# EAGLE design PixiFlood_SMT (EAGLE 7.3.0)
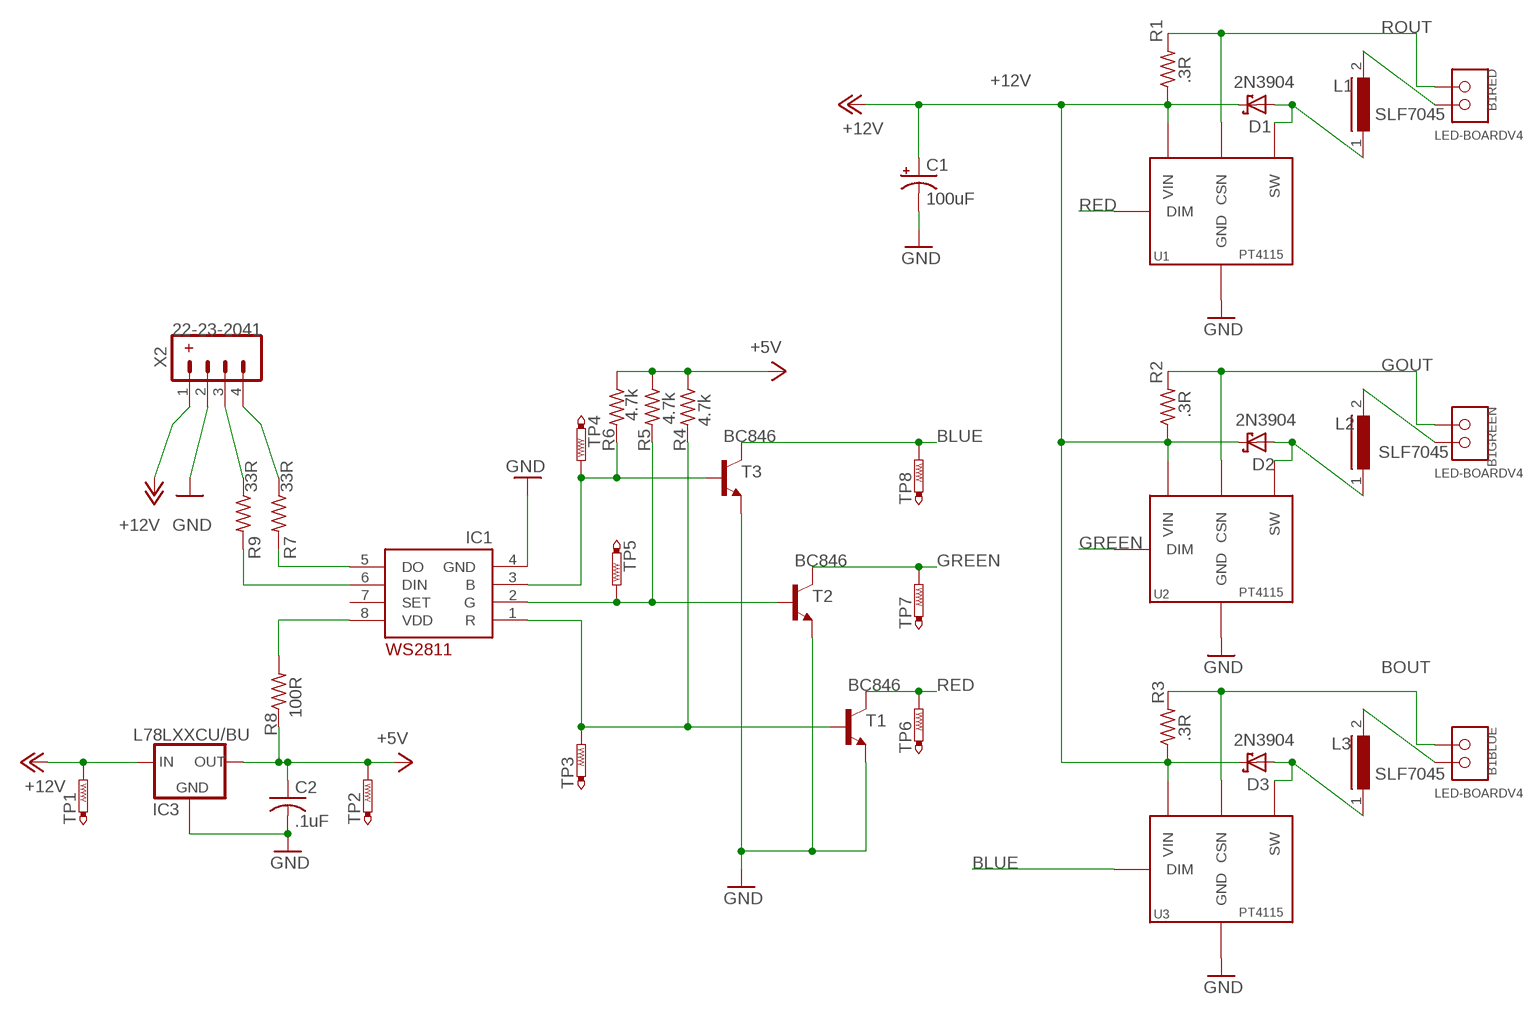
[diagram p0: schematic, sheet 1]

## Parts
B1  LED-BOARDV4  [LED_BOARD-V4]
C1  100uF  CPOL-USTT2D6L  [TT2D6L]
C2  .1uF  C-USC0805  [C0805]
D1  2N3904  SCHOTTKY-DIODESS16  [SMA-DO214AC]
D2  2N3904  SCHOTTKY-DIODESS16  [SMA-DO214AC]
D3  2N3904  SCHOTTKY-DIODESS16  [SMA-DO214AC]
IC1  WS2811-SOP8  [SO08-SKINNYPADS]
IC3  L78LXXCU/BU  [SOT89]
L1  SLF7045  [SLF7045]
L2  SLF7045  [SLF7045]
L3  SLF7045  [SLF7045]
R1  .3R  R-US_R1206  [R1206]
R2  .3R  R-US_R1206  [R1206]
R3  .3R  R-US_R1206  [R1206]
R4  4.7k  R-US_R0805  [R0805]
R5  4.7k  R-US_R0805  [R0805]
R6  4.7k  R-US_R0805  [R0805]
R7  33R  R-US_M0805  [M0805]
R8  100R  R-US_R0805  [R0805]
R9  33R  R-US_R0805  [R0805]
T1  BC846  [SOT23]
T2  BC846  [SOT23]
T3  BC846  [SOT23]
TP1  PTR1TP20SQ  [TP20SQ]
TP2  PTR1TP20R  [TP20R]
TP3  PTR1B1,27  [B1,27]
TP4  PTR1B1,27  [B1,27]
TP5  PTR1B1,27  [B1,27]
TP6  PTR1B1,27  [B1,27]
TP7  PTR1B1,27  [B1,27]
TP8  PTR1B1,27  [B1,27]
U1  PT4115B89E  [SOT89-5]
U2  PT4115B89E  [SOT89-5]
U3  PT4115B89E  [SOT89-5]
X2  22-23-2041  [22-23-2041]

## Nets
+5V: C2.1 IC3.1(OUT) R4.1 R5.1 R6.1 R8.1 TP2.TP
+12V: C1.+ D1.K(C) D2.K(C) D3.K(C) IC3.3(IN) R1.1 R2.1 R3.1 TP1.TP U1.5(VIN) U2.5(VIN) U3.5(VIN) X2.1
BLUE: T3.3(C) TP8.TP U3.3(DIM)
BOUT: B1.B+ B1.B+@2 R3.2 U3.4(CSN)
GND: C1.- C2.2 IC1.4(GND) IC3.4(GND1) T1.2(E) T2.2(E) T3.2(E) U1.2(GND) U1.2@1(GND) U1.2@2(GND) U1.2@3(GND) U2.2(GND) U2.2@1(GND) U2.2@2(GND) U2.2@3(GND) U3.2(GND) U3.2@1(GND) U3.2@2(GND) U3.2@3(GND) X2.2
GOUT: B1.G+ B1.G+@1 R2.2 U2.4(CSN)
GREEN: T2.3(C) TP7.TP U2.3(DIM)
N$1: D1.A L1.1 U1.1(SW)
N$2: D3.A L3.1 U3.1(SW)
N$3: B1.R- B1.R-@1 L1.2
N$4: R7.1 X2.4
N$5: D2.A L2.1 U2.1(SW)
N$6: R9.1 X2.3
N$7: IC1.5(DO) R7.2
N$8: IC1.6(DIN) R9.2
N$9: B1.G- B1.G-@1 L2.2
N$10: B1.B- B1.B-@1 L3.2
N$15: IC1.3(B) R6.2 T3.1(B) TP4.TP
N$18: IC1.2(G) R5.2 T2.1(B) TP5.TP
N$20: IC1.1(R) R4.2 T1.1(B) TP3.TP
RED: T1.3(C) TP6.TP U1.3(DIM)
ROUT: B1.R+ B1.R+@1 R1.2 U1.4(CSN)
VDD: IC1.8(VDD) R8.2
Unconnected: IC1.7(SET) IC3.2(GND)

## Library data of the parts
B1 = special:LED-BOARD
C1 = rcl:CPOL-US: POLARIZED CAPACITOR, American symbol
C2 = rcl:C-US: CAPACITOR, American symbol
D1-D3 = diode:SCHOTTKY-DIODE: Schottky Diode
IC1 = MyLibrary:WS2811
IC3 = regulators:L78LXXCU/BU: VOLTAGE REGULATOR
L1-L3 = inductors:SLF7045: SMD Inductors(Coils) For Power Line (Wound, Magnetic Shielded) Source: TDK, e531_slf7045.pdf
R1-R6 = resistor:R-US_: RESISTOR, American symbol
R7-R9 = rcl:R-US_: RESISTOR, American symbol
T1-T3 = transistor:BC846: NPN TRANSISTOR
TP1-TP8 = testpad:PTR1: TEST PIN
U1-U3 = drivers:PT4115: 30V, 1.2A Step-down High Brightness LED Driver with 5000:1 Dimming PDF: http://www.google.pl/url?sa=t&rct=j&q=PT4115&source=web&cd=1&ved=0CC4QFjAA&url=http%3A%2F%2Fwww.micro-bridge.com%2Fdata%2FCRpowtech%2FPT4115E.pdf&ei=9NbxUKXPJNSzhAem2oGoAQ&usg=AFQjCNEsPWIIWjIVjxpF5YN6SPR3coTTpw&bvm=bv.1357700187,d.d2k
X2 = connectors:22-23-2041: .100" (2.54mm) Center Header - 4 Pin; MF: MOLEX; MPN: 22-23-2041; OC_FARNELL: 1462920; OC_NEWARK: 38C0355

## Board
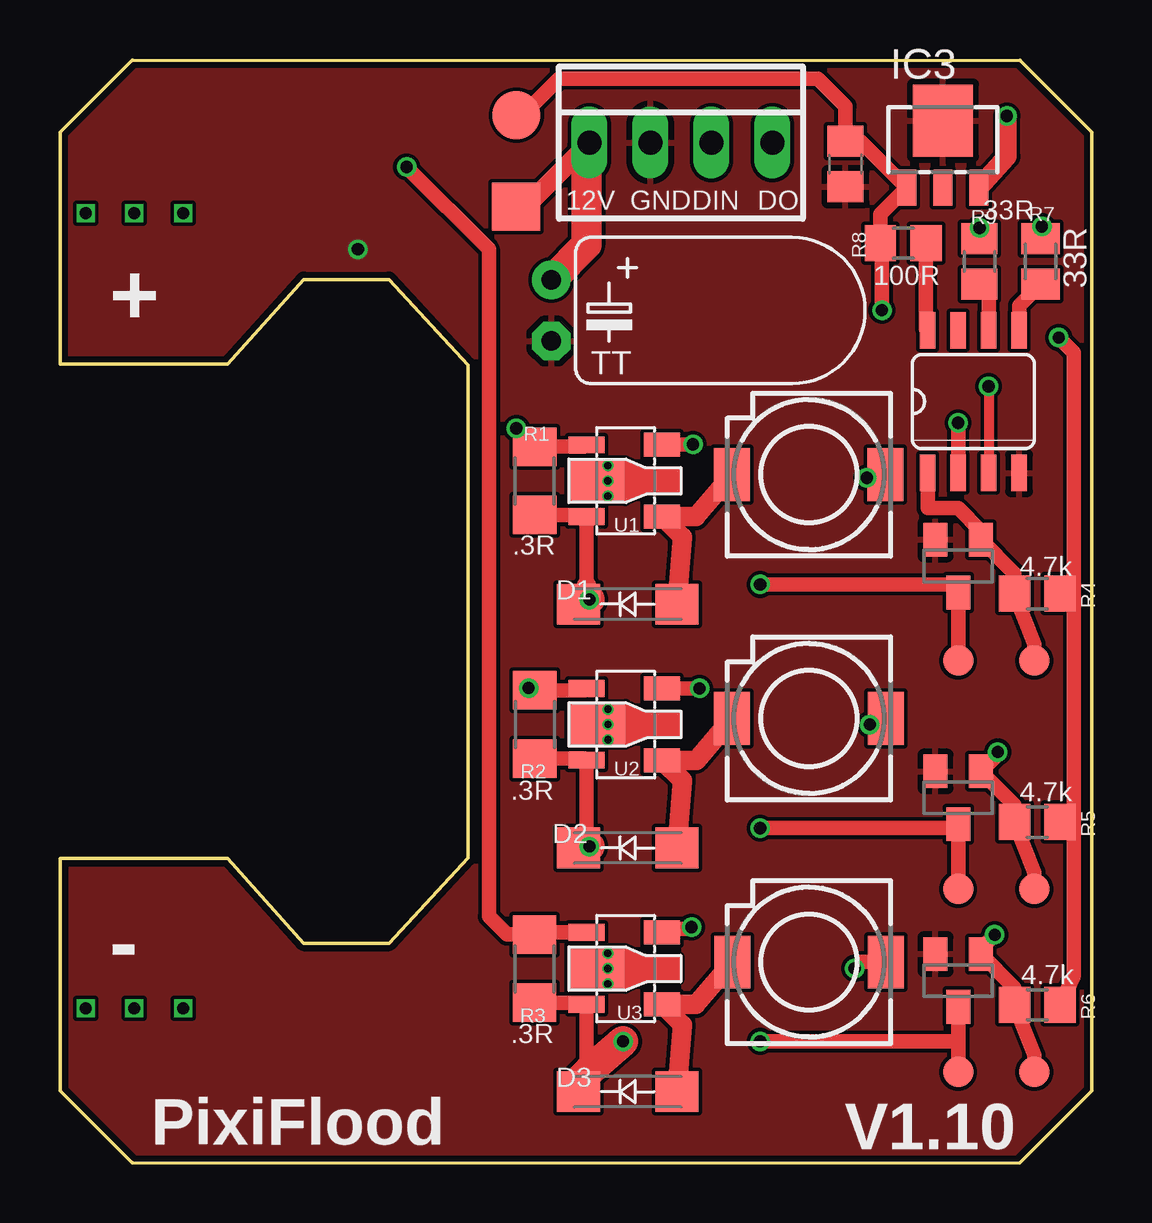
[diagram p1: board, top side]
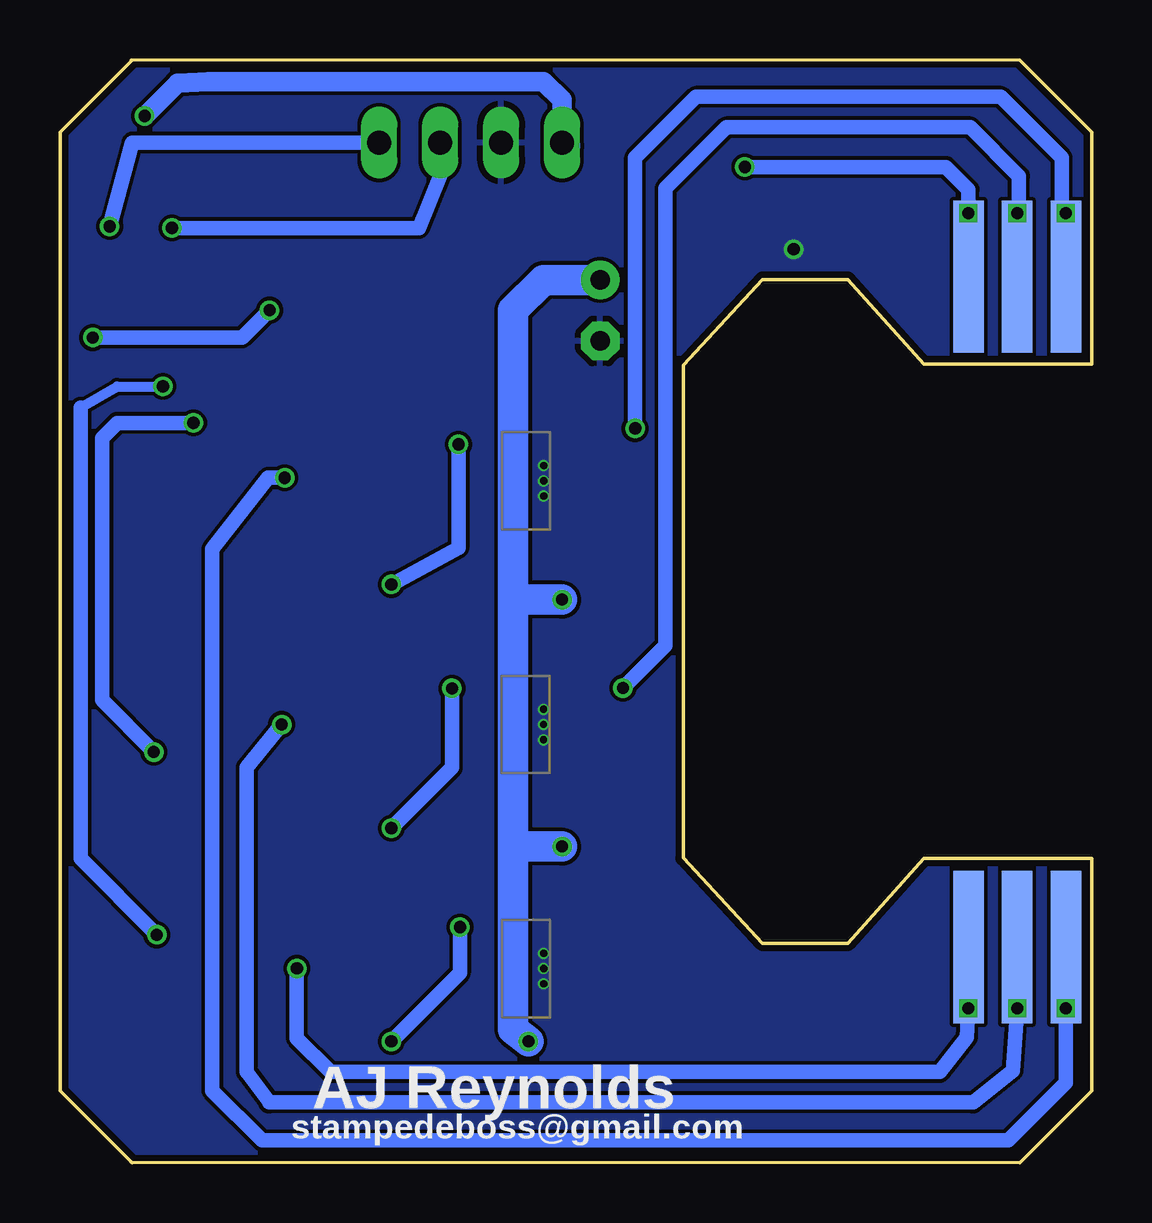
[diagram p2: board, bottom side, seen from below]

Size 43 x 45.96 mm. Coordinates in mm from the lower left corner, seen from the top.
Copper layers (1*16): Top 0.035mm / dielectric 1.5mm / Bottom 0.035mm
Design rules "default *": minimum track width 5mil, minimum drill 12mil, track to track 6mil, track to pad 6mil, pad to pad 6mil, via to via 6mil, smd to smd 0mil, copper to edge 10mil, drill to drill 10mil, minimum pad ring 0mil, minimum via ring 6mil, stop-mask expansion 2mil, vias tented up to drill 100mil, thermal gap 10mil

### Footprints (pad centres in the part's own frame; a part is rotated, then mirrored left to right if it is on the bottom)
LED_BOARD-V4 = smd 1.27 x 6.35 bottom: B+ 5.156,36.957; B- 5.156,9.017; G+ 3.124,36.957; G- 3.124,9.017; R+ 1.092,36.957; R- 1.092,9.017 | drill 0.5 square: B+@2 5.156,39.599; B-@1 5.156,6.452; G+@1 3.124,39.599; G-@1 3.124,6.452; R+@1 1.092,39.599; R-@1 1.092,6.452
TT2D6L = drill 0.813 pad 1.6: + -1.27,0 | drill 0.813 pad 1.6 octagon: - 1.27,0
C0805 = smd 1.3 x 1.5: 1 -0.95,0; 2 0.95,0
SMA-DO214AC = smd 1.8 x 1.7: A -2.05,0; K 2.05,0
SO08-SKINNYPADS = smd 0.66 x 1.524: 1 -1.905,-2.973; 2 -0.635,-2.973; 3 0.635,-2.973; 4 1.905,-2.973; 5 1.905,2.973; 6 0.635,2.973; 7 -0.635,2.973; 8 -1.905,2.973
SOT89 = smd 0.8 x 1.5: 1 -1.5,-1.75; 2 0,-1.75; 3 1.5,-1.75 | smd 2.5 x 3: 4 0,1.05
SLF7045 = smd 1.5 x 2.2: 1 -3.2,0; 2 3.2,0
R1206 = smd 1.6 x 1.803: 1 -1.422,0; 2 1.422,0
R0805 = smd 1.3 x 1.5: 1 -0.95,0; 2 0.95,0
M0805 = smd 1.3 x 1.6: 1 -0.95,0; 2 0.95,0
SOT23 = smd 1 x 1.4: 1 -0.95,-1.1; 2 0.95,-1.1; 3 0,1.1
TP20SQ = smd 2 x 2: TP 0,0
TP20R = smd 2 x 2: TP 0,0
B1,27 = smd 1.27 x 1.27: TP 0,0
SOT89-5 = smd 1 x 1.5: 1 -1.496,-1.496; 3 1.505,-1.498 | smd 1.778 x 2.286: 2 0.006,1.201 | drill 0.305 pad 0.305: 2@1 -0.635,0.762; 2@2 0,0.762; 2@3 0.635,0.762 | smd 0.7 x 1.5: 4 1.504,1.654; 5 -1.487,1.645
22-23-2041 = drill 1 long: 1 -3.81,0; 2 -1.27,0; 3 1.27,0; 4 3.81,0

### Placement (x,y rotation side)
B1  -0.03,-0.03 0 top
C1  20.48,35.52 270 top
C2  32.74,41.63 270 top
D1  23.66,23.28 180 top
D2  23.66,13.12 180 top
D3  23.66,2.96 180 top
IC1  38.07,31.72 0 top
IC3  36.8,42.39 0 top
L1  31.22,28.68 0 top
L2  31.22,18.52 0 top
L3  31.22,8.36 0 top
R1  19.79,28.42 90 top
R2  19.79,18.27 90 top
R3  19.79,8.09 90 top
R4  40.74,23.72 180 top
R5  40.74,14.2 180 top
R6  40.74,6.58 180 top
R7  40.87,37.57 270 top
R8  35.15,38.33 0 top
R9  38.33,37.57 270 top
T1  37.44,24.87 180 top
T2  37.44,15.21 180 top
T3  37.44,7.59 180 top
TP1  19.02,39.84 90 top
TP2  19.02,43.66 0 top
TP3  40.61,20.93 0 top
TP4  40.61,3.78 0 top
TP5  40.61,11.4 0 top
TP6  37.44,20.93 0 top
TP7  37.44,11.4 0 top
TP8  37.44,3.78 0 top
U1  23.6,28.42 90 top
U2  23.6,18.26 90 top
U3  23.6,8.09 90 top
X2  25.88,42.52 0 top

### Tracks (layer width: path | path; a pad name or v marks a point on that pad's centre or on a via)
+5V  (via drill 0.51)
  Top 0.61: TP2.TP 19.28,43.66 20.8,45.19 31.6,45.19 32.74,44.04 C2.1 33.37,42.58 IC3.1 34.2,39.54 R8.1 34.26,38.27 v34.26,35.53 | v41.63,34.39 42.27,33.76 42.27,23.47 | 42.27,23.47 42.27,13.94 | 42.27,13.94 42.27,7.79 R6.1 | R4.1 41.95,23.47 42.27,23.47 | R5.1 41.95,13.94 42.27,13.94
  Bottom 0.61: v34.26,35.53 35.41,34.39 v41.63,34.39
+12V  (via drill 0.51)
  Top 0.61: 21.95,23.22 21.56,22.83 21.56,23.02 D1.K | R3.1 21.89,6.67 U3.5 21.95,3.73 21.72,3.5 | R2.1 21.89,16.84 U2.5 21.96,13.9 D2.K | R1.1 21.89,27 U1.5 21.95,24.05
  Top 0.813: IC3.3 39.47,41.94 v39.47,43.63 | TP1.TP 19.4,39.84 21.94,42.39 X2.1 | 21.95,24.05 D1.K
  Top 1.27: v23.47,5.05 22.01,3.78 21.72,3.5 D3.K | D2.K v22.07,13.18 | D1.K 21.95,23.34 v22.07,23.47 | 21.94,42.39 21.94,38.26 C1.+
  Bottom 0.813: X2.1 22.07,44.3 22.83,45.06 36.8,45.06 38.1,45 v39.47,43.63
  Bottom 1.27: X2.1 21.94,42.39 | C1.+ 22.85,36.79 24.1,35.53 24.1,23.34 | 24.1,23.34 24.1,13.06 | 24.1,13.06 24.1,5.56 v23.47,5.05 | v22.07,13.18 23.98,13.18 24.1,13.06 | v22.07,23.47 23.98,23.47 24.1,23.34
BLUE  (via drill 0.51 pad 0.3)
  Top 0.406: 25.25,9.75 U3.3
  Top 0.61: T3.3 37.44,5.05 | 37.44,5.05 TP8.TP | 25.25,9.75 26.26,9.75 v26.33,9.82 | v29.18,5.05 37.44,5.05
  Bottom 0.61: v26.33,9.82 26.33,7.91 v29.18,5.05
BOUT  (via drill 0.51)
  Top 0.61: U3.4 19.87,9.59 R3.2 18.63,9.51 17.88,10.26 17.88,38.07 v14.45,41.5
  Bottom 0.61: 4.93,39.6 5.02,39.69 | 5.02,39.69 5.05,39.73 | B1.B+ 5.05,37.11 5.05,39.5 | v14.45,41.5 6.07,41.5 5.13,40.56 B1.B+@2 5.05,39.5 | 5.05,39.5 5.05,39.66 5.02,39.69
GND  (via drill 0.51)
  other vias: 12.42,38.07
  pour Bottom: -0.03,-0.03 43.15,-0.03 43.15,46.2 -0.03,46.2
  pour Top: -0.03,-0.03 43.15,-0.03 43.15,46.2 -0.03,46.2
GOUT  (via drill 0.51)
  Top 0.61: U2.4 21.87,19.69 R2.2 19.63,19.69 v19.53,19.79
  Bottom 0.61: B1.G+@1 B1.G+ 3.02,36.98 3.02,41.12 5.05,43.15 15.21,43.15 17.75,40.61 17.75,21.56 v19.53,19.79
GREEN  (via drill 0.51)
  Top 0.61: v26.66,19.77 U2.3 | v29.18,13.94 37.27,13.94 T2.3 TP7.TP
  Bottom 0.61: v29.18,13.94 26.66,16.47 v26.66,19.77
N$1
  Top 0.813: L1.1 26.52,26.92 U1.1 25.94,26.07 D1.A
N$2
  Top 0.813: L3.1 26.52,6.59 U3.1 25.94,5.74 D3.A
N$3  (via drill 0.51 pad 0.3)
  Top 0.61: v33.63,28.55 34.39,28.68 L1.2
  Bottom 0.61: B1.R- B1.R-@1 1.07,3.33 3.47,0.93 34.58,0.93 36.65,3 36.65,25.58 34.32,28.55 v33.63,28.55
N$4  (via drill 0.51)
  Top 0.406: v40.93,39.03 40.93,38.77
  Top 0.61: 40.93,38.77 R7.1
  Bottom 0.61: X2.4 39.98,42.52 v40.93,39.03
N$5
  Top 0.813: L2.1 26.53,16.77 U2.1 25.94,15.92 D2.A
N$6  (via drill 0.51)
  Top 0.61: v38.33,38.96 R9.1
  Bottom 0.61: v38.33,38.96 28.04,38.96 27.15,41.12 X2.3
N$7
  Top 0.61: IC1.5 39.98,35.73 R7.2
N$8
  Top 0.61: IC1.6 38.71,36.24 R9.2
N$9  (via drill 0.51 pad 0.3)
  Top 0.61: v33.76,18.26 34.02,18.52 L2.2
  Bottom 0.61: B1.G- B1.G-@1 3.29,3.84 4.93,2.51 34.28,2.51 34.28,2.53 35.22,3.78 35.22,16.48 v33.76,18.26
N$10  (via drill 0.51 pad 0.3)
  Top 0.61: v33.13,8.1 33.39,8.36 L3.2
  Bottom 0.61: B1.B- B1.B-@1 5.19,5.23 6.32,3.78 31.72,3.78 33.13,5.19 v33.13,8.1
N$15  (via drill 0.51)
  Top 0.406: v38.71,32.36 IC1.3
  Top 0.61: v38.96,9.5 38.39,8.93 T3.1 39.79,7.29 R6.2 40.61,4.49 TP4.TP
  Bottom 0.406: 42.14,31.47 40.61,32.36 v38.71,32.36
  Bottom 0.61: 42.14,31.47 42.14,12.67 v38.96,9.5
N$18  (via drill 0.51)
  Top 0.61: IC1.2 v37.44,30.84 | v39.09,17.12 39.09,17.02 T2.1 39.79,14.91 R5.2 40.61,12.11 TP5.TP
  Bottom 0.61: 37.31,30.84 v37.44,30.84 40.61,30.84 41.25,30.2 41.25,19.28 v39.09,17.12
N$20
  Top 0.61: IC1.1 36.17,27.28 37.44,27.28 38.39,26.33 T1.1 39.79,24.56 R4.2 40.61,21.63 TP3.TP
RED  (via drill 0.51)
  Top 0.406: 26.12,29.93 v26.39,29.95
  Top 0.61: U1.3 26.12,29.93 | TP6.TP T1.3 37.1,24.1 v29.18,24.1
  Bottom 0.61: v26.39,29.95 26.39,25.63 v29.18,24.1
ROUT  (via drill 0.51 pad 0.3)
  Top 0.61: U1.4 21.86,29.84 R1.2 v19.02,30.61
  Bottom 0.61: B1.R+@1 B1.R+ 1.07,39.17 1.24,39.34 1.24,41.88 3.78,44.42 16.48,44.42 19.02,41.88 v19.02,30.61
VDD
  Top 0.61: R8.2 36.1,34.76 IC1.8

### Text on the board
tPlace: 12V | GND | DIN | DO | PixiFlood | V1.10
bPlace: AJ Reynolds | stampedeboss@gmail.com